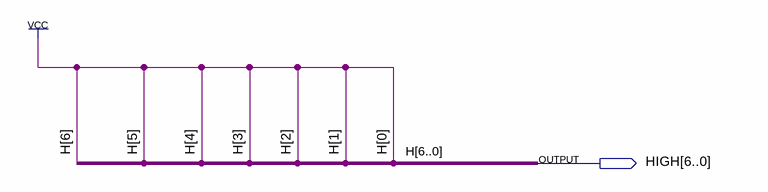
[diagram p0: schematic sheet]
// Quartus schematic 6bits_high.bdf as structural Verilog: 0 symbols, 1 pins
module \6bits_high  (
  output [6:0] HIGH
);


  assign HIGH = {7{1'b1}};
endmodule
